# EAGLE board MegaFly_rev4 (EAGLE 6.1)
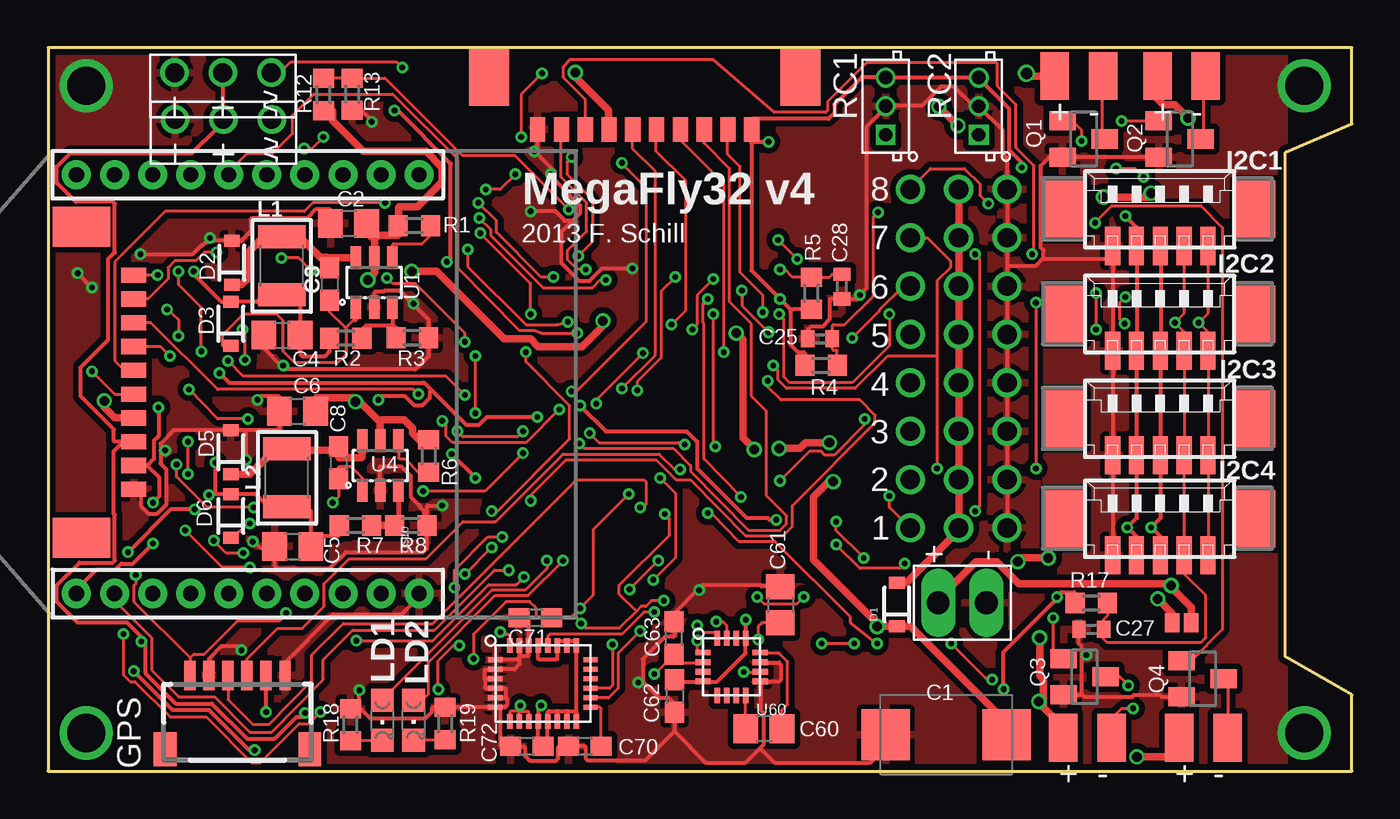
[diagram p2: board, top side]
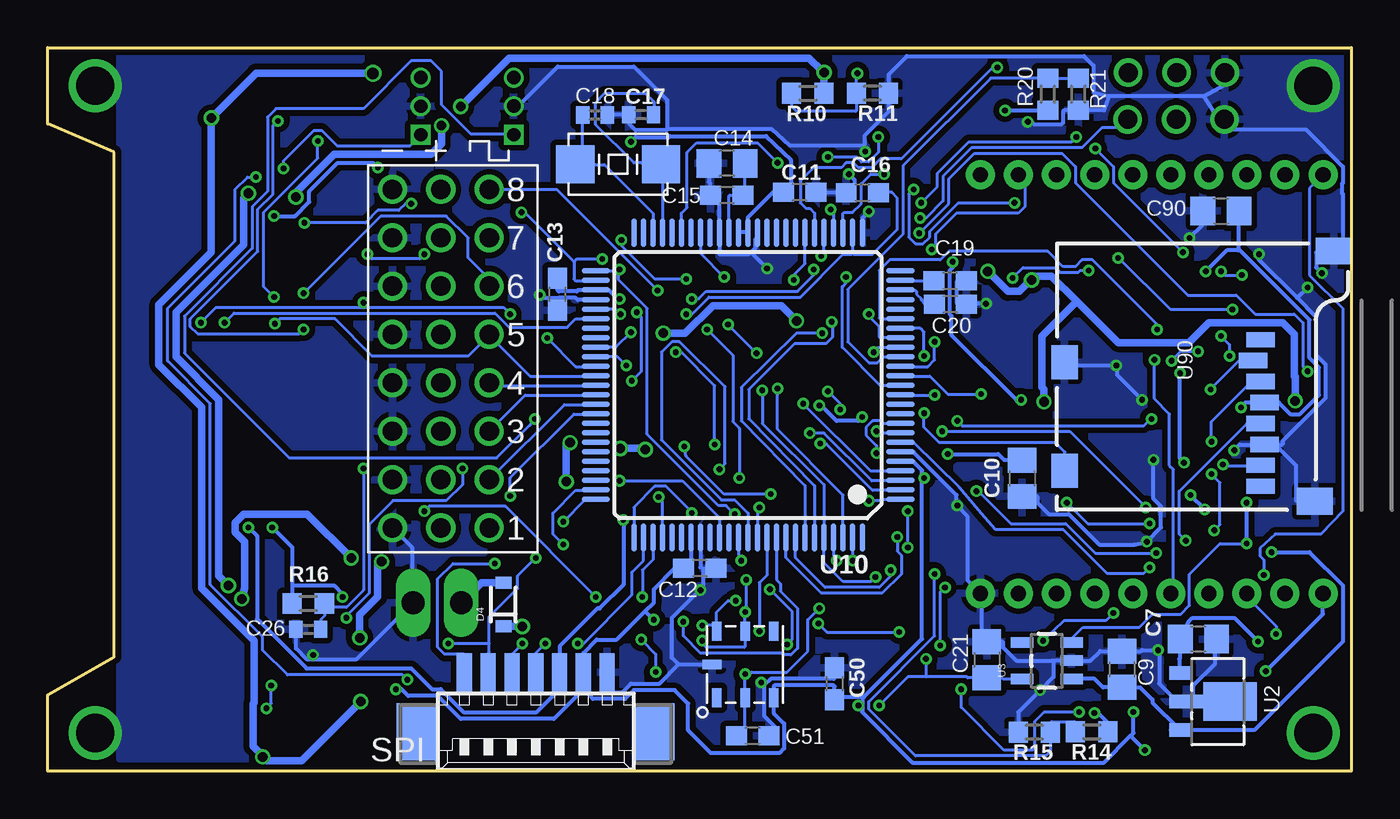
[diagram p3: board, bottom side, seen from below]

Size 68.5 x 38 mm. Coordinates in mm from the lower left corner, seen from the top.
Outline: 0,0 68.5,0 68.5,4 65,6 65,32.5 68.5,34 68.5,38 0,38 0,0
Copper layers (1*16): Top 0.035mm / dielectric 1mm / Bottom 0.035mm
Design rules: minimum track width 0.15mm, minimum drill 0.3mm, track to track 0.15mm, track to pad 0.15mm, pad to pad 0.15mm, via to via 0.15mm, smd to smd 0.15mm, copper to edge 10mil, drill to drill 8mil, minimum pad ring 6mil, minimum via ring 6mil, stop-mask expansion 4mil, vias tented up to drill 0.51mm, thermal gap 10mil
Net classes: 0 default: width 0.15 mm, drill 0.3 mm, clearance 0.15 mm; 1 power: width 0.2 mm, drill 0.3 mm, clearance 0.15 mm; 2 more_power: width 0.4 mm, drill 0.5 mm, clearance 0.15 mm

## Footprints (pad centres in the part's own frame; a part is rotated, then mirrored left to right if it is on the bottom)
MOLEX_CONNECTOR_10PINS = smd 0.8 x 1.3: P$1 -11.65,-0.65; P$2 -10.4,-0.65; P$3 -9.15,-0.65; P$4 -7.9,-0.65; P$5 -6.65,-0.65; P$6 -5.4,-0.65; P$7 -4.15,-0.65; P$8 -2.9,-0.65; P$9 -1.65,-0.65; P$10 -0.4,-0.65 | smd 2.1 x 3: P$11 -14.2,-3.4; P$12 2.15,-3.4
D/7343-31R = smd 2.55 x 2.7: + 3.175,0; - -3.175,0
C0805 = smd 1.3 x 1.5: 1 -0.95,0; 2 0.95,0
C0603 = smd 1.1 x 1: 1 -0.85,0; 2 0.85,0
C0402 = smd 0.7 x 0.9: 1 -0.65,0; 2 0.65,0
SOD-323 = smd 0.63 x 0.83: 1 -1.15,0; 2 1.15,0
CON-JST2_SM06B-SRSS-TB = smd 0.6 x 1.55: 1 -2.5,2.975; 2 -1.5,2.975; 3 -0.5,2.975; 4 0.5,2.975; 5 1.5,2.975; 6 2.5,2.975 | smd 1.2 x 1.8: FIT@1 -3.8,-0.9; FIT@2 3.8,-0.9
MOLEX_CONNECTOR_5_PINS_VERTICAL = smd 0.8 x 2: 1 2.48,-2.57; 2 1.23,-2.57; 3 -0.02,-2.57; 4 -1.27,-2.57; 5 -2.52,-2.57 | smd 2.1 x 3: S1 4.98,-0.645; S2B -5,-0.645
C1210 = smd 1.2 x 2.5: 1 -1.524,0; 2 1.524,0
CHIPLED_0805 = smd 1.2 x 1.2: A 0,-1.05; C 0,1.05
SOT23 = smd 1 x 1.4: 1 -0.95,-1.1; 2 0.95,-1.1; 3 0,1.1
R0603 = smd 1 x 1.1: 1 -0.85,0; 2 0.85,0
MOLEX_CONNECTOR_7PINS = smd 0.8 x 2: 1 3.75,-2.5; 2 2.5,-2.5; 3 1.25,-2.5; 4 0,-2.5; 5 -1.25,-2.5; 6 -2.5,-2.5; 7 -3.75,-2.5 | smd 2.1 x 3: S1 6.25,0.625; S2 -6.25,0.625
SOT23-6 = smd 0.55 x 1.2: 1 -0.95,-1.3; 2 0,-1.3; 3 0.95,-1.3; 4 0.95,1.3; 5 0.015,1.3; 6 -0.95,1.3
SOT89 = smd 0.7 x 1.1: 1 -1.5,-1.75; 3 1.5,-1.75 | smd 0.7 x 1.8: 2 0,-1.4 | smd 2 x 2.8: 4 0,0.9
SOT23-5 = smd 0.55 x 1.2: 1 -0.95,-1.3; 2 0,-1.3; 3 0.95,-1.3; 4 0.95,1.3; 5 -0.95,1.3
TQFP100 = smd 1.5 x 0.3: 1 -8,6; 2 -8,5.5; 3 -8,5; 4 -8,4.5; 5 -8,4; 6 -8,3.5; 7 -8,3; 8 -8,2.5; 9 -8,2; 10 -8,1.5; 11 -8,1; 12 -8,0.5; 13 -8,0; 14 -8,-0.5; 15 -8,-1; 16 -8,-1.5; 17 -8,-2; 18 -8,-2.5; 19 -8,-3; 20 -8,-3.5; 21 -8,-4; 22 -8,-4.5; 23 -8,-5; 24 -8,-5.5; 25 -8,-6; 51 8,-6; 52 8,-5.5; 53 8,-5; 54 8,-4.5; 55 8,-4; 56 8,-3.5; 57 8,-3; 58 8,-2.5; 59 8,-2; 60 8,-1.5; 61 8,-1; 62 8,-0.5; 63 8,0; 64 8,0.5; 65 8,1; 66 8,1.5; 67 8,2; 68 8,2.5; 69 8,3; 70 8,3.5; 71 8,4; 72 8,4.5; 73 8,5; 74 8,5.5; 75 8,6 | smd 0.3 x 1.5: 26 -6,-8; 27 -5.5,-8; 28 -5,-8; 29 -4.5,-8; 30 -4,-8; 31 -3.5,-8; 32 -3,-8; 33 -2.5,-8; 34 -2,-8; 35 -1.5,-8; 36 -1,-8; 37 -0.5,-8; 38 0,-8; 39 0.5,-8; 40 1,-8; 41 1.5,-8; 42 2,-8; 43 2.5,-8; 44 3,-8; 45 3.5,-8; 46 4,-8; 47 4.5,-8; 48 5,-8; 49 5.5,-8; 50 6,-8; 76 6,8; 77 5.5,8; 78 5,8; 79 4.5,8; 80 4,8; 81 3.5,8; 82 3,8; 83 2.5,8; 84 2,8; 85 1.5,8; 86 1,8; 87 0.5,8; 88 0,8; 89 -0.5,8; 90 -1,8; 91 -1.5,8; 92 -2,8; 93 -2.5,8; 94 -3,8; 95 -3.5,8; 96 -4,8; 97 -4.5,8; 98 -5,8; 99 -5.5,8; 100 -6,8
BMP180 = smd 0.5 x 1: 1 -1.5,-1.75; 2 0,-1.75; 3 1.5,-1.75; 4 1.5,1.75; 5 0,1.75; 6 -1.5,1.75 | smd 1 x 0.5: 7 -1.75,0
LPCC16_0.5MM = smd 0.8 x 0.3: P$1 -1.5,0.75; P$2 -1.5,0.25; P$3 -1.5,-0.25; P$4 -1.5,-0.75; P$9 1.5,-0.75; P$10 1.5,-0.25; P$11 1.5,0.25; P$12 1.5,0.75 | smd 0.3 x 0.8: P$5 -0.75,-1.5; P$6 -0.25,-1.5; P$7 0.25,-1.5; P$8 0.75,-1.5; P$13 0.75,1.5; P$14 0.25,1.5; P$15 -0.25,1.5; P$16 -0.75,1.5
LSM330DLC = smd 0.75 x 0.28: P$1 -2.5,1.25; P$2 -2.5,0.75; P$3 -2.5,0.25; P$4 -2.5,-0.25; P$5 -2.5,-0.75; P$6 -2.5,-1.25; P$15 2.5,-1.25; P$16 2.5,-0.75; P$17 2.5,-0.25; P$18 2.5,0.25; P$19 2.5,0.75; P$20 2.5,1.25 | smd 0.28 x 0.75: P$7 -1.75,-2; P$8 -1.25,-2; P$9 -0.75,-2; P$10 -0.25,-2; P$11 0.25,-2; P$12 0.75,-2; P$13 1.25,-2; P$14 1.75,-2; P$21 1.75,2; P$22 1.25,2; P$23 0.75,2; P$24 0.25,2; P$25 -0.25,2; P$26 -0.75,2; P$27 -1.25,2; P$28 -1.75,2
MICRO-SD-SOCKET-PP = smd 0.8 x 1.5: 1 -8.94,10.7; 2 -7.84,10.3; 3 -6.74,10.7; 4 -5.64,10.9; 5 -4.54,10.7; 6 -3.44,10.9; 7 -2.34,10.7; 8 -1.24,10.7 | smd 1.8 x 1.4: CD1 -2.05,0.4; CD2 -7.75,0.4 | smd 1.4 x 1.9: GND1 -13.6,14.55; GND3 -0.45,13.55
HEADER3X8 = drill 1.016: P$1 -2.54,10.16; P$2 0,10.16; P$3 2.54,10.16; P$4 -2.54,7.62; P$5 0,7.62; P$6 2.54,7.62; P$7 -2.54,5.08; P$8 0,5.08; P$9 2.54,5.08; P$10 -2.54,2.54; P$11 0,2.54; P$12 2.54,2.54; P$13 -2.54,0; P$14 0,0; P$15 2.54,0; P$16 -2.54,-2.54; P$17 0,-2.54; P$18 2.54,-2.54; P$19 -2.54,-5.08; P$20 0,-5.08; P$21 2.54,-5.08; P$22 -2.54,-7.62; P$23 0,-7.62; P$24 2.54,-7.62
SOLDER_JUMPER_2WAY = smd 0.75 x 1: P$1 -0.5,0; P$2 0.5,0
SMD_CRYSTAL_ABM = smd 2 x 2: P$1 -2.25,0; P$2 2.25,0
POWER = drill 1.2 long: P$1 0,2.54; P$2 0,0
XBEE-1 = drill 0.8 pad 1.524: 1 -11,20; 2 -11,18; 3 -11,16; 4 -11,14; 5 -11,12; 6 -11,10; 7 -11,8; 8 -11,6; 9 -11,4; 10 -11,2; 11 11,2; 12 11,4; 13 11,6; 14 11,8; 15 11,10; 16 11,12; 17 11,14; 18 11,16; 19 11,18; 20 11,20
JST_1.5MM_3WAY = drill 0.7 square: P$1 0,1.5 | drill 0.7: P$2 0,0; P$3 0,-1.5
POWER_SMALL_SMD = smd 1.5 x 2.5: + -1.27,0; - 1.27,0
SERVO_COMPACT = drill 1: P$1 0,2.54; P$2 0,0; P$3 0,-2.54

## Placement (x,y rotation side)
ANA  MOLEX_CONNECTOR_10PINS  [MOLEX_CONNECTOR_10PINS]  5.15,14.4 270 top
C1  100uF  [D/7343-31R]  47.18,1.91 0 top
C2  10uF  [C0805]  15.78,28.77 0 top
C3  100nF  [C0603]  14.79,25.58 270 top
C4  10uF  [C0805]  12.29,22.9 0 top
C5  10uF  [C0805]  12.85,11.8 0 top
C6  10uF  [C0805]  13.1,18.9 0 top
C7  10uF  [C0805]  8.03,6.93 180 bottom
C8  100nF  [C0603]  15.25,16.2 270 top
C9  10uF  [C0805]  12.05,5.35 270 bottom
C10  10uF  [C0805]  17.3,15.38 270 bottom
C11  100nF  [C0603]  28.99,30.41 180 bottom
C12  100nF  [C0603]  34.23,10.67 180 bottom
C13  100nF  [C0603]  41.7,25.05 90 bottom
C14  10uF  [C0805]  32.8,31.92 180 bottom
C15  100nF  [C0603]  32.81,30.26 180 bottom
C16  100nF  [C0603]  25.69,30.38 0 bottom
C17  22pF  [C0402]  37.31,34.48 180 bottom
C18  22pF  [C0402]  39.74,34.46 0 bottom
C19  100nF  [C0603]  21.08,25.75 180 bottom
C20  100nF  [C0603]  21.07,24.53 180 bottom
C21  10uF  [C0805]  19.15,5.85 270 bottom
C25  22pF  [C0402]  40.55,22.7 0 top
C26  22pF  [C0402]  54.8,7.45 0 bottom
C27  22pF  [C0402]  54.8,7.45 0 top
C28  22pF  [C0402]  41.7,25.45 90 top
C50  100nF  [C0603]  27.16,4.59 270 bottom
C51  100nF  [C0603]  31.45,1.85 180 bottom
C60  220nF  [C0805]  37.6,2.22 180 top
C61  4.7uF  [C0805]  38.47,8.74 270 top
C62  100nF  [C0603]  32.92,3.94 270 top
C63  100nF  [C0603]  32.89,6.99 90 top
C70  100nF  [C0603]  28.2,1.3 180 top
C71  100nF  [C0603]  25.6,8.05 180 top
C72  100nF  [C0603]  25.15,1.3 180 top
C90  10uF  [C0805]  6.85,29.42 0 bottom
D1  [SOD-323]  44.6,8.75 90 top
D2  [SOD-323]  9.65,26.7 90 top
D3  [SOD-323]  9.6,23.5 90 top
D4  [SOD-323]  44.55,8.75 90 bottom
D5  [SOD-323]  9.6,16.75 90 top
D6  [SOD-323]  9.6,13.4 90 top
GPS  ADRUPILOT_GPS_HEADERSIDE  [CON-JST2_SM06B-SRSS-TB]  9.95,2.05 0 top
I2C1  I2C_BUS_PICOVERTICAL  [MOLEX_CONNECTOR_5_PINS_VERTICAL]  58.45,30.15 0 top
I2C2  I2C_BUS_PICOVERTICAL  [MOLEX_CONNECTOR_5_PINS_VERTICAL]  58.45,24.65 0 top
I2C3  I2C_BUS_PICOVERTICAL  [MOLEX_CONNECTOR_5_PINS_VERTICAL]  58.45,19.15 0 top
I2C4  I2C_BUS_PICOVERTICAL  [MOLEX_CONNECTOR_5_PINS_VERTICAL]  58.45,13.9 0 top
L1  10uH  [C1210]  12.27,26.54 270 top
L2  10uH  [C1210]  12.55,15.4 270 top
LD1  green  [CHIPLED_0805]  17.56,2.67 180 top
LD2  red  [CHIPLED_0805]  19.2,2.68 180 top
Q1  N-CHANNEL_SOT23  [SOT23]  54.4,33.2 270 top
Q2  N-CHANNEL_SOT23  [SOT23]  59.45,33.2 270 top
Q3  N-CHANNEL_SOT23  [SOT23]  54.45,4.95 270 top
Q4  N-CHANNEL_SOT23  [SOT23]  60.65,4.85 270 top
R1  100k  [R0603]  19.24,28.65 180 top
R2  31.6k  [R0603]  15.63,22.74 0 top
R3  10k  [R0603]  19.13,22.76 0 top
R4  6k8  [R0603]  40.61,21.31 0 top
R5  6k8  [R0603]  40.1,25.1 90 top
R6  100k  [R0603]  20,16.55 90 top
R7  62k  [R0603]  16.15,12.9 0 top
R8  10k  [R0603]  19.05,12.9 0 top
R10  10k  [R0603]  28.56,35.59 0 bottom
R11  1k  [R0603]  25.16,35.6 180 bottom
R12  10k  [R0603]  14.46,35.53 270 top
R13  1k  [R0603]  15.98,35.55 90 top
R14  5.6k  [R0603]  13.64,2.07 0 bottom
R15  1k  [R0603]  16.65,2.05 0 bottom
R16  6k8  [R0603]  54.81,8.8 0 bottom
R17  6k8  [R0603]  54.81,8.83 0 top
R18  1k  [R0603]  15.88,2.44 270 top
R19  1k  [R0603]  20.86,2.5 270 top
R20  5.6k  [R0603]  15.95,35.55 270 bottom
R21  1k  [R0603]  14.35,35.55 90 bottom
SPI  MOLEX_CONNECTOR_7PINS  [MOLEX_CONNECTOR_7PINS]  42.85,2.7 180 bottom
U1  LM2734  [SOT23-6]  17.13,25.66 0 top
U2  LDO_3PINSOT89_MC78LXX  [SOT89]  7.27,3.66 270 bottom
U3  V_REG_MIC5235-3.3  [SOT23-5]  16,5.8 90 bottom
U4  LM2734  [SOT23-6]  17.45,16.05 0 top
U10  AT32UC3C1512/1256/1128  [TQFP100]  31.7,20.27 180 bottom
U50  BMP180  [BMP180]  31.85,5.6 0 bottom
U60  HMC5883L  [LPCC16_0.5MM]  35.91,5.47 0 top
U70  LSM330DLC  [LSM330DLC]  26,4.6 0 top
U90  USD-SOCKETNEW  [MICRO-SD-SOCKET-PP]  15.47,13.72 270 bottom
U$1  AVR32_JTAG+SERIAL  [MOLEX_CONNECTOR_10PINS]  25.32,33.05 180 top
U$3  SERVOCONNECTOR_X8STANDARD  [HEADER3X8]  47.84,22.93 180 bottom
U$4  SOLDER_JUMPER_2WAY  [SOLDER_JUMPER_2WAY]  59.55,7.8 0 top
U$8  CRYSTAL  [SMD_CRYSTAL_ABM]  38.52,31.88 0 bottom
U$9  POWER  [POWER]  49.3,8.84 90 top
U$10  XBEE-1B1  [XBEE-1]  21.49,20.33 90 top
U$11  SPEKTRUM_RECEIVER  [JST_1.5MM_3WAY]  44,34.93 180 top
U$12  SPEKTRUM_RECEIVER  [JST_1.5MM_3WAY]  48.89,34.92 180 top
U$13  POWERSMALL_SMD  [POWER_SMALL_SMD]  54.15,36.5 0 top
U$15  POWERSMALL_SMD  [POWER_SMALL_SMD]  59.55,36.5 0 top
U$16  SENSOR  [SERVO_COMPACT]  9.21,34.23 270 top
U$17  SENSOR  [SERVO_COMPACT]  9.18,36.68 270 top
U$19  POWERSMALL_SMD  [POWER_SMALL_SMD]  54.6,1.75 0 top
U$20  POWERSMALL_SMD  [POWER_SMALL_SMD]  60.7,1.75 0 top

## Tracks (layer width: path | path; a pad name or v marks a point on that pad's centre or on a via)
3V3_ANA  (via drill 0.3)
  Top 0.15: U70.P$7 24.25,3.1 24.3,3.15 24.7,3.15 | 24.75,3.1 24.7,3.15 | U70.P$8 24.75,3.1 | U70.P$9 25.25,3.1 25.2,3.15 24.8,3.15 24.75,3.1 | v24.8,3.45 24.75,3.4 24.75,3.2 24.7,3.15 | U60.P$2 34.4,5.7 32.95,5.7 32.9,5.75 32.9,6.1 C63.1 32.85,5.7 32.45,5.7 v31.85,5.1 | v35.05,17.05 34.95,17.15 v34.95,24 | v30.5,14.55 28.65,12.7 28.65,9.25 v27.95,8.55 27.45,8.05 C71.1 25.7,8.05 25.65,8.1 25.65,8.55 25.3,8.9 24.05,8.9 22.35,7.2 v22.35,5.9
  Bottom 0.15: v24.8,3.45 23.3,4.95 22.35,4.95 | 22.35,4.95 20.2,4.95 20.15,4.9 C21.2 18.35,4.9 18.3,4.85 U3.5 | 26.2,27.2 26.15,27.15 25.15,27.15 23.85,28.45 23.85,30.1 24.15,30.4 24.8,30.4 C16.2 | U10.27 26.2,27.2 | C51.2 31.9,1.85 31.85,1.9 U50.2 31.85,4.85 31.73,4.97 | v27.95,8.55 28.55,7.95 28.55,6.3 29.65,5.2 31.5,5.2 31.73,4.97 | 31.73,4.97 v31.85,5.1 | v34.95,24 34.65,24 33.75,24.9 28.95,24.9 26.7,27.15 26.25,27.15 26.2,27.2 | v35.05,17.05 34.95,16.55 32.95,14.55 v30.5,14.55 | v22.35,5.9 22.35,4.95
5V_ANA  (via drill 0.3)
  Top 0.2: U$17.P$2 9.2,36.2 9.2,33.8 U$16.P$2 9.1,33.8 8.9,33.8 7.55,32.45 1.15,32.45 0.45,31.75 0.45,30.9 1.45,29.9 3.4,29.9 3.5,29.8 3.5,27.25 3.15,26.9 3.15,22.65 1.7,21.2 1.7,19.7 3.45,17.95 3.45,17.35 3.5,17.3 3.85,17.3 3.9,17.25 | v13.5,3.05 13.3,2.85 13.05,2.85 11.9,1.7 10.45,1.7 8.6,3.55 6.7,3.55 5.1,5.15 5.1,6.6 v4.9,6.8 4.95,6.85 4.95,7 4.15,7.8 1.55,7.8 0.45,8.9 0.45,9.75 1.65,10.95 3.4,10.95 3.5,11.05 3.5,13.45 3.45,13.5 3.45,16.8 3.9,17.25 | ANA.P$8 3.95,17.3 3.9,17.25
  Bottom 0.2: v13.5,3.05 13.3,3.05 12.8,2.55 12.8,2.1 R14.2 | v4.9,6.8 6.15,8.05 8.35,8.05 8.5,7.9 9,6.95 C7.2 9,6.85 9,5.95 9.05,5.9 9.05,5.2 U2.1
+3V3  (via drill 0.3)
  Top 0.2: R2.1 14.8,22.7 14.8,22.05 14.55,21.8 13.35,21.8 13.25,21.9 13.25,22.85 C4.2 13.25,23 13.25,24.95 13.2,25 12.35,25 L1.2 12.25,25 11.3,25 10.95,24.65 D3.2 9.1,24.65 7.65,26.1 v7.65,26.25 | 39.05,24.2 39.1,24.25 R5.1 | 39.05,24.2 39,24.15 39,22.4 39.4,22 39.7,22 39.75,21.95 39.75,21.35 R4.1 | 39.05,24.2 v38.45,24.8 36.95,26.3 36.95,33 37,33.05 | 37,33.05 v37.85,33.05 | 37,33.05 36.95,33.1 36.95,33.65 U$1.P$1 36.95,33.7 36.95,34.2 37,34.25 41,34.25 41.3,34.55 41.3,35 42.75,36.45 44,36.45 U$11.P$3 44.1,36.45 48.85,36.45 U$12.P$3 48.95,36.35 50.5,34.8 50.5,32.6 51.15,31.95 v51.15,31.7 | I2C4.4 57.2,11.35 57.2,12.3 v56.7,12.8 57.2,13.3 57.2,16.55 I2C3.4 57.2,16.65 57.2,22 I2C2.4 57.2,22.1 57.2,27.55 I2C1.4 57.2,27.65 57.2,28.55 v56.6,29.15 | R17.1 53.95,8.85 53.95,9.35 53.9,9.4 53.25,9.4 v53,9.15 52.95,9.1 52.95,9 50.2,6.25 v50.2,4.3 | C62.1 32.9,4.75 32.9,4.7 34.4,4.7 U60.P$4 34.5,4.7 35.15,4.7 36.65,6.2 36.65,6.95 U60.P$13 36.65,7.05 v36.65,7.95 | U70.P$25 25.75,5.9 25.8,5.85 26.7,5.85 26.75,5.9 U70.P$23 26.75,6.85 27.25,6.85 U70.P$22 27.3,6.85 27.75,6.85 U70.P$21 27.75,3.2 27.7,3.15 | 26.75,3.1 U70.P$12 | 26.75,3.1 26.7,3.15 26.3,3.15 26.25,3.1 U70.P$11 26.25,1.3 C72.1 25.75,1.3 U70.P$10 25.75,3.3 v25.9,3.45 | 27.25,3.1 U70.P$13 | 27.25,3.1 27.2,3.15 26.8,3.15 26.75,3.1 | U70.P$14 27.75,3.1 27.7,3.15 | 27.7,3.15 27.3,3.15 27.25,3.1 | 5.2,16.05 ANA.P$9 | 5.2,16.05 5.55,16.4 5.55,17.35 5.8,17.6 v5.8,19.1 | 5.2,16.05 5.85,15.4 5.85,14.45 v5.5,14.1 | v5.5,11.95 4.45,10.9 3.85,10.9 3.55,10.6 2.55,10.6 1.5,9.55 1.5,9.35 U$10.1 | v11.45,3.1 GPS.5
  Top 0.2: v4.5,5.25 6.55,3.2 8.45,3.2 10.55,1.1 v10.85,1.1 | v22.45,15.4 v21.2,16.65
  Bottom 0.15: U3.3 14.7,6.95 14.1,7.55 11.15,7.55 10.45,8.25 8.95,8.25 8.5,8.7 8.5,10.35 6.9,11.95 v5.5,11.95
  Bottom 0.2: 5.9,27.4 C90.2 | 5.9,27.4 2.2,23.7 2.2,21.7 1.7,21.2 1.7,19.75 2.7,18.75 3.2,18.75 3.8,19.35 4.5,19.35 U90.4 4.65,19.35 5.55,19.35 v5.8,19.1 | v7.65,26.25 6.55,27.35 5.95,27.35 5.9,27.4 | C13.2 41.7,25.85 41.7,25.25 41.65,25.2 40.7,25.2 40.65,25.25 39.7,25.25 U10.53 39.65,25.25 39,25.25 38.55,24.8 v38.45,24.8 | U10.39 32.2,28.3 31.75,28.3 U10.38 31.7,29.1 30.4,30.4 C11.2 29.75,30.4 29.45,30.4 29.45,32.1 30.75,33.35 35.8,33.35 35.85,33.3 37.6,33.3 v37.85,33.05 | 55.65,9.75 55.65,11.75 v56.7,12.8 | 55.65,9.75 55.65,8.85 R16.1 | v53,9.15 53,9.3 53.45,9.75 55.65,9.75 | U10.82 34.7,10.8 34.65,10.7 35.05,10.65 C12.2 35.15,10.65 35.55,10.65 36.65,9.55 36.65,8.85 37.1,8.4 | 37.1,8.4 38.6,6.9 39.65,6.9 40.35,6.2 SPI.6 | 37.1,8.4 v36.65,7.95 | SPI.6 40.35,4.3 39.85,3.8 38.15,3.8 37.7,4.25 35.55,4.25 34.85,3.55 34.85,2.15 33.65,0.95 30.05,0.95 29.8,1.2 29.8,2.5 30.35,3.05 U50.3 30.35,4.45 30.3,4.5 27.2,4.5 27.15,4.45 C50.2 27.1,3.9 25.7,3.9 | v50.2,4.3 49.9,4.3 49.55,3.95 48,3.95 46.8,2.75 41.9,2.75 40.4,4.25 SPI.6 | v51.15,31.7 51.4,31.95 53.25,31.95 54.75,30.45 54.75,29.9 55.5,29.15 v56.6,29.15 | v5.5,11.95 v5.5,14.1 | 22.55,15.4 22.55,6.95 25.6,3.9 25.7,3.9 | 22.55,15.4 22.55,15.8 23,16.25 23.7,16.25 U10.5 | v11.45,3.1 11.45,2 11.6,1.85 | 11.6,1.85 13,0.45 23.05,0.45 25.7,3.1 25.7,3.45 | 25.7,3.9 25.7,3.45 | 25.7,3.45 v25.9,3.45 | v4.5,5.25 1.5,8.25 1.5,9.3 U$10.1 | 11.6,1.85 v10.85,1.1 | v21.2,16.65 18.55,16.65 18.25,16.35 17.3,16.35 C10.1 | v22.45,15.4 22.55,15.4
+6V  (via drill 0.3)
  Top 0.2: I2C1.3 58.45,27.55 58.45,22.1 I2C2.3 58.45,22 58.45,16.65 I2C3.3 58.45,16.55 58.45,13.3 v57.95,12.8 58.45,12.3 58.45,11.35 I2C4.3 | R7.1 15.3,12.4 15.25,12.35 13.85,12.35 13.8,12.3 C5.2 13.8,13.65 13.55,13.9 12.6,13.9 L2.2 12.55,13.9 11.55,13.9 10.9,14.55 D6.2 8.85,14.55 8.8,14.6 | v18.2,34.7 18.25,34.65 18.4,34.65 21.15,31.9 21.15,26.95 v20.95,26.75 | v17.35,19.5 17.55,19.7 18.75,19.7 19.25,19.2 19.65,19.2 20.05,19.6 20.05,19.95 | 20.05,19.95 20.15,20 19.75,20.4 9.5,20.4 v9,20.9 | 8.8,14.6 v8.8,16.2 | v4.2,11.5 6.45,13.75 v7.7,13.75 | v8.45,14.5 8.55,14.5 8.6,14.55 8.75,14.55 8.8,14.6 | v38.25,13.2 37.9,13.2 37.8,13.3 36.7,13.3 34.1,15.9 34.1,17.3 33.55,17.85 29.3,17.85 v27.95,19.2 | v25.7,18.6 23.05,18.6 22.65,18.2 21.95,18.2 20.2,19.95 20.05,19.95
  Bottom 0.2: v57.95,12.8 57.5,12.35 57.5,8 54.9,5.4 49.4,5.4 48.3,4.3 47.85,4.3 46.65,3.1 42.8,3.1 41.6,4.3 SPI.5 41.6,6.55 39.6,8.55 39.5,8.55 38.25,9.8 v38.25,13.2 | U3.1 13.5,4.85 13.05,4.4 C9.2 11.1,4.4 10.45,3.75 10.45,3.6 9.1,2.25 9.5,2.15 9.05,2.15 U2.3 8.95,2.15 5.1,2.15 0.45,6.8 0.45,9.75 2.2,11.5 v4.2,11.5 | v18.2,34.7 R20.2 | v20.95,26.75 20.95,26.45 21.1,26.3 21.1,24 21,23.9 21,22.9 17.6,19.5 v17.35,19.5 | v9,20.9 9,16.4 v8.8,16.2 | v8.45,14.5 v7.7,13.75 | v27.95,19.2 27.85,19.2 27.05,18.4 25.9,18.4 v25.7,18.6
+12V  (via drill 0.5)
  Top 0.4: v27.7,36.7 27.7,36.45 29.45,34.7 29.45,33.7 U$1.P$7 | U$4.P$2 60.05,8.6 58.95,9.7 | 58.95,9.7 58.8,9.85 51,9.85 49.85,11 48.75,11 46.8,9.05 46.8,8.85 U$9.P$1 | v47.8,33.9 v46.8,34.9 | v55.45,30.15 57.75,30.15 v57.95,30.35 | v59,9.75 58.95,9.7
  Bottom 0.4: R10.2 v27.7,36.7 27.85,36.8 28.5,37.45 44.25,37.45 v46.8,34.9 | D4.2 45.7,9.9 U$9.P$1 | v47.8,33.9 47.8,32.95 48.35,32.4 53.45,32.4 55.45,30.4 v55.45,30.15 | v57.95,30.35 58.2,30.1 58.2,27.65 61.75,24.1 61.75,21.75 59.5,19.5 59.5,10.25 v59,9.75
ADC2  (via drill 0.3)
  Top 0.15: v5.75,26.05 ANA.P$1 | v6.85,26.25 6.85,25.55 8.05,24.35 v8.05,22.05 | v9.45,21.55 10.25,20.75 20.9,20.75 v21.9,19.75
  Bottom 0.15: v5.75,26.05 6.65,26.05 v6.85,26.25 | v8.05,22.05 8.95,22.05 v9.45,21.55 | v21.9,19.75 23.7,19.75 U10.12
ADC3  (via drill 0.3)
  Top 0.15: ANA.P$2 5.25,24.8 6.3,25.85 6.3,26.45 6.65,26.8 7.75,26.8 8.2,27.25 v8.85,27.25 | v13.45,32.7 13.85,32.7 v14.45,33.3 | v22.6,29.85 23.55,28.9 23.55,28.3 25.9,25.95 v26.55,25.95
  Bottom 0.15: v8.85,27.25 12.5,30.9 12.5,31.75 v13.45,32.7 | v14.45,33.3 14.7,33.05 20.1,33.05 21.75,31.4 21.75,30.7 v22.6,29.85 | v26.55,25.95 26.55,25.65 26.75,25.45 26.75,22.25 24.75,20.25 23.7,20.25 U10.13
ADC4  (via drill 0.3)
  Top 0.15: ANA.P$3 5.4,23.55 8.9,20.05 19.2,20.05 v19.45,19.8
  Bottom 0.15: v19.45,19.8 21.2,19.8 22.15,20.75 23.7,20.75 U10.14
ADC5  (via drill 0.3)
  Top 0.15: ANA.P$4 5.9,22.3 v6.4,21.8 | v6.85,22.85 6.85,23.7 v6.25,24.25 | v12.25,26.95 13.15,26.95 v13.8,26.3 | v17.8,25.9 18.1,25.6 19.3,25.6 21.9,23 v21.9,22.55
  Bottom 0.15: v6.4,21.8 6.4,22.4 v6.85,22.85 | v6.25,24.25 9.5,24.25 v12.25,26.95 | v13.8,26.3 14.25,26.3 14.35,26.2 15.3,26.2 15.55,26.45 17.25,26.45 v17.8,25.9 | v21.9,22.55 21.9,21.6 22.25,21.25 23.7,21.25 U10.15
ADC6
  Bottom 0.15: R21.2 R20.1 18.95,36.4 23.55,31.8 23.55,28.2 26.45,25.3 26.45,22.55 25.35,21.45 24.9,21.45 24.6,21.75 23.7,21.75 U10.16
ADC7  (via drill 0.3)
  Top 0.15: v25.1,22 25.1,21.5 27.4,19.2 27.4,17.45 23.6,13.65 v23.3,13.65 | v21.9,10.35 v23.3,11.75
  Bottom 0.15: R14.1 14.5,2.1 14.5,2.55 14.55,2.6 15.75,2.6 15.8,2.55 R15.2 15.8,2 15.8,1.05 16.05,0.8 22.9,0.8 25.35,3.25 25.35,3.65 21.9,7.1 v21.9,10.35 | v25.1,22 24.85,22.25 23.7,22.25 U10.17 | v23.3,11.75 v23.3,13.65
ADC10  (via drill 0.3)
  Top 0.15: R12.1 14.5,36.4 15.95,36.4 R13.2 16.05,36.4 17.7,36.4 21.75,32.35 24.5,32.35 v27.35,29.5
  Bottom 0.15: U10.29 27.2,29.35 v27.35,29.5
ADC11  (via drill 0.3)
  Top 0.15: v27.85,27.05 28.6,27.8 28.6,30 27.25,31.35 27.25,32 v27.5,32.25 | v24.85,33.3 24.85,35.55 v25.95,36.65
  Bottom 0.15: R10.1 29.4,35.55 29.4,34.9 29.15,34.65 26.05,34.65 26,34.7 R11.2 26,35.65 26,36.6 v25.95,36.65 | U10.30 27.7,27.2 v27.85,27.05 | v27.5,32.25 26,32.25 25.75,32 25.35,32 24.85,32.5 v24.85,33.3
ADC12  (via drill 0.3)
  Top 0.15: v18.6,36.95 18.3,37.25 12.75,37.25 11.75,36.25 U$17.P$1
  Bottom 0.15: U10.31 28.2,29.3 28.45,29.55 28.65,29.55 28.95,29.85 28.95,31 28.25,31.7 26.8,31.7 26.55,31.95 26.15,31.95 25.9,31.7 25.2,31.7 24.75,32.15 23.65,32.15 18.95,36.85 18.7,36.8 v18.6,36.95
ADC13  (via drill 0.3)
  Top 0.15: v29.3,25.8 29,25.8 28.6,25.4 26,25.4 23.25,28.15 23.25,28.45 v22.65,29.05
  Bottom 0.15: U10.32 28.7,26.65 29.3,26.05 v29.3,25.8 | v22.65,29.05 22.35,29.05 21.45,29.95 21.45,31.25 19.95,32.75 14.15,32.75 13.1,33.8 11.75,33.8 U$16.P$1
BAT_FILTERED  (via drill 0.5)
  Top 0.4: C1.+ 50.35,1.95 50.35,2.85 50.3,2.9 50,2.9 45.3,7.6 D1.1 v43.55,7.6 43.4,7.7 43.4,7.9 40.2,11.1 40.2,14.4 41,15.2 v41.25,15.2 | R6.2 19.5,17.4 19.15,17.75 19.15,18 18.7,18.45 17.55,18.45 17.45,18.35 | 17.45,18.35 17.45,17.4 U4.5 | C6.2 14.05,19.55 14.1,19.6 16.15,19.6 16.25,19.5 | 16.25,19.5 17.3,18.45 17.45,18.35 | 17.15,27.95 17.35,28.15 18.35,28.15 18.4,28.2 18.4,28.6 R1.2 18.4,28.85 18.4,29.6 18.45,29.65 19.4,29.65 20.7,30.95 20.7,31.7 19.85,32.55 16.55,32.55 14.95,34.15 14.95,34.65 14.9,34.7 14.5,34.7 R12.2 | 17.15,27.95 17.15,27 U1.5 17.15,26.8 17.15,26.2 17.1,26.15 17.1,26.1 v16.8,25.8 | ANA.P$7 3.5,18.55 2.95,19.1 v2.95,19.45 | C2.2 16.75,28.75 16.75,28.3 17,28.05 17.15,27.95 | v16.15,19.4 16.25,19.5 | v41.05,17.25 39.8,17.25 39.5,16.95 v38.4,16.95 | v37.1,16.9 36.5,17.5 36.5,22.65 v36.15,23 | v29.15,23.65 29.15,23.4 28.05,22.3 25.75,22.3 25.35,22.7 23.95,22.7 20.4,26.25 v19.1,26.25
  Bottom 0.4: v43.55,7.6 D4.1 | v2.95,19.45 2.95,20.7 3,20.75 3,22.95 3.6,23.55 7.5,23.55 8.55,22.5 12.25,22.5 14.43,24.68 | 14.43,24.68 15.75,26 16.6,26 v16.8,25.8 16.95,25.7 17.45,25.2 18.05,25.2 v19.1,26.25 | v16.15,19.4 16.15,20.05 16.25,20.15 16.25,22.85 14.43,24.68 | v41.25,15.2 41.25,17.05 v41.05,17.25 | v38.4,16.95 37.15,16.95 v37.1,16.9 | v36.15,23 35,23 33.55,24.45 29.95,24.45 v29.15,23.65
COMPASS_DRDY  (via drill 0.3)
  Top 0.15: v35.1,7.85 35.45,7.85 35.65,7.65 35.65,7 U60.P$15
  Bottom 0.15: v35.1,7.85 35.1,7.1 34.2,6.2 29.95,6.2 29.85,6.1 29.45,6.1 29.1,6.45 29.1,8.55 30,9.45 30,9.85 30.2,10.05 U10.91
D_RXD  (via drill 0.3)
  Top 0.15: v28.25,26.35 27.8,26.35 27.3,26.85 27.3,27.35 28.3,28.35 28.3,29.85 26.95,31.2 26.95,33.7 U$1.P$9 | 34.4,24.55 v34.65,24.8 | 34.4,24.55 34.4,23.55 34.45,23.5 34.45,16.4 v36.4,14.4 | 34.45,24.5 34.4,24.55
  Bottom 0.15: v28.25,26.35 28.25,26.05 29.1,25.2 33.9,25.2 34.3,24.8 v34.65,24.8 | v36.4,14.4 36.4,14.35 36.2,14.15 U10.79
D_TXD  (via drill 0.3)
  Top 0.15: v51.7,27.15 51.8,27.25 51.8,31.8 50.85,32.75 50.85,35 49.85,36 49.85,37.2 43,37.2 40.95,35.15 40.95,34.7 40.85,34.6 38.15,34.6 34.95,37.35 27.4,37.35 27.05,36.95 27.05,36.45 28.2,35.3 28.2,33.7 U$1.P$8 | v48.7,27.15 48.95,26.9 48.95,13.9 v48.7,13.65 | v39.7,9.15 39.35,8.8 37.6,8.8 v37.25,9.15
  Bottom 0.15: v51.7,27.15 51.45,26.9 48.95,26.9 v48.7,27.15 | v48.7,13.65 48.45,13.9 44.45,13.9 v39.7,9.15 | v37.25,9.15 37.25,10.55 36.7,11.1 U10.78
DAC0  (via drill 0.3)
  Top 0.15: ANA.P$5 4,21.05 3.5,21.55 3.5,26.75 6.15,29.4 13.45,29.4 13.9,29.85 v17.7,29.85 | v23,30.55 23.75,30.55 v24.55,31.35
  Bottom 0.15: v17.7,29.85 20.65,29.85 22.15,28.35 22.15,28.05 22.5,27.7 22.9,27.7 23.25,28.05 23.25,30.3 v23,30.55 | v24.55,31.35 25.25,31.35 25.75,30.85 25.75,29.8 26.2,29.35 26.65,29.35 26.7,29.3 U10.28
DAC1  (via drill 0.3)
  Top 0.15: ANA.P$6 3.5,19.8 v2.3,21 | v22.7,28.25 25.35,25.6 v25.35,24
  Bottom 0.15: v2.3,21 2.55,21.25 2.55,23.55 3,24 5.05,24 6.05,25 8.6,25 14.5,30.9 14.5,31.75 15.2,32.45 19.8,32.45 21.15,31.1 21.15,29.8 v22.7,28.25 | v25.35,24 25.35,23.9 24.8,23.35 24.8,22.8 24.75,22.75 23.7,22.75 U10.18
GND  (via drill 0.3, 2)
  Top 0.2: 19.18,24.52 18.45,25.25 17.7,25.25 17.65,25.2 17.2,25.2 17.15,25.15 17.15,24.4 U1.2 | 19.18,24.52 20,23.7 20,22.8 R3.2 20,22.7 20,21.8 19.3,21.1 12.45,21.1 12.3,21.25 | 12.3,21.25 11.35,22.2 11.35,22.85 C4.1 | v19.2,24.55 19.18,24.52 | v12.35,21.3 12.3,21.25 | C2.1 14.85,28.8 14.85,29.45 14.8,29.5 14.05,29.5 13.6,29.05 10.7,29.05 10.65,29 10.65,28.35 10.15,27.85 D2.2 8.65,27.85 v8.5,28 8.1,27.6 8.05,27.6 7.6,27.15 v4.85,27.15 | 10.4,17.9 12.1,17.9 12.15,17.95 C6.1 12.15,19.65 12.1,19.7 11.2,19.7 v11,19.5 | 10.4,17.9 D5.2 6.6,17.9 5.9,17.2 5.9,16.85 | ANA.P$10 4.85,14.8 4.9,14.75 4.9,13.9 5.3,13.5 5.7,13.5 6.2,14 6.2,15.85 5.9,16.15 5.9,16.85 | 5.9,16.85 v6.15,16.85 | GPS.2 8.45,5.9 9.1,6.55 9.95,6.55 v10.15,6.35 | 19.75,13.55 19.85,13.45 | 19.85,13.45 19.9,13.4 R8.2 19.9,11.7 19.7,11.5 15.65,11.5 14.8,10.65 12.05,10.65 11.9,10.8 C5.1 11.9,11.3 11.85,11.25 v10.75,12.05 | v20.7,13.95 19.95,13.95 19.9,13.9 19.9,13.5 | 19.9,13.5 19.85,13.45 | GPS.6 12.45,5.7 14.95,8.2 18.55,8.2 19.45,9.1 19.45,9.3 U$10.10 19.5,9.35 | C71.2 25.2,8.05 25.25,8 U70.P$26 25.25,6.1 25.2,6.05 24.75,6.05 | U70.P$27 24.75,6.05 | 24.75,6.05 24.75,5.85 | 24.75,5.85 24.75,5.6 24.5,5.35 U70.P$2 23,5.35 22.95,5.3 22.95,4.9 23,4.85 | 24.75,5.85 U70.P$1 | 23,4.85 22.95,4.8 22.95,4.4 23,4.35 U70.P$4 24,4.35 24.05,4.3 24.05,3.85 | U70.P$3 23,4.85 | U70.P$6 24,3.35 24.1,3.45 24.1,3.8 24.05,3.85 | U70.P$5 24.05,3.85 | U70.P$6 23.75,3.3 23.75,1.35 23.8,1.3 C72.2 25,1.3 25.05,1.25 25.05,0.8 25.3,0.55 26.7,0.55 26.8,0.65 26.8,1.25 26.85,1.3 C70.2 28.2,1.3 28.25,1.25 28.25,0.65 28.35,0.55 31.35,0.55 32.9,2.1
  Top 0.2: U70.P$6 20.95,3.35 R19.1 20.2,3.35 20.15,3.3 20.15,3.1 19.8,2.75 16.95,2.75 16.4,3.3 15.9,3.3 R18.1 16.35,3.35 v16.35,4.25 | U60.P$11 37.45,5.7 38.4,5.7 38.5,5.6 38.5,4.8 38.4,4.7 37.45,4.7 U60.P$9 37.45,4.6 37.45,3.2 37.6,3.05 37.6,1.4 37.4,1.2 | 34.15,9.55 34.35,9.75 37.45,9.75 37.5,9.7 38.45,9.7 C61.1 | 34.15,9.55 32.9,8.3 C63.2 32.9,7.75 32.9,7.1 32.85,7.05 32.4,7.05 31.25,5.9 31.25,4.7 | 31.25,4.7 32.1,3.85 32.6,3.85 32.9,3.55 32.9,3.1 C62.2 32.9,3 32.9,2.1 | 37.4,1.2 36.65,0.45 34.55,0.45 32.9,2.1 | 37.4,1.2 38.15,0.45 43.2,0.45 44,1.25 C1.- | v31,4.65 31.2,4.65 31.25,4.7 | v34.2,9.5 34.15,9.55 | v10.4,16.35 10.4,17.9 | C27.1 54.15,6.7 54.3,6.55 54.3,5.95 | 54.3,4.05 54.3,5.95 | 54.3,4.05 54.25,4 Q3.2 | Q4.2 58.5,3.9 58.4,4 57.05,4 56.95,3.9 54.45,3.9 54.3,4.05 | v54.55,6.1 54.4,5.95 54.3,5.95 | I2C4.5 55.95,11.35 55.95,16.55 I2C3.5 55.95,16.65 55.95,22 I2C2.5 55.95,22.1 55.95,27.55 I2C1.5 55.9,26.9 52.35,26.9 52.3,26.95 | Q2.2 Q1.2 52.6,32.25 52.15,31.8 52.15,27.5 52.3,27.35 52.3,26.95 | U$3.P$3 50.4,12.8 50.4,15.3 U$3.P$6 50.4,15.4 50.4,17.85 U$3.P$9 50.4,17.95 50.4,20.35 U$3.P$12 50.4,20.45 50.4,22.9 U$3.P$15 50.4,23 50.4,25.45 U$3.P$18 50.4,25.55 50.4,26.55 | 50.4,26.55 50.4,28 U$3.P$21 50.4,28.1 50.4,30.5 U$3.P$24 50.4,30.6 50.4,32.2 50.15,32.45 50.15,33.65 48.9,34.9 U$12.P$2 48.8,34.95 48.6,34.95 47.6,35.95 46.9,35.95 45.9,34.95 44.05,34.95 U$11.P$2 44,34.85 43,33.85 43,25.35 v42.65,25 42.65,24.85 42.6,24.8 C28.1 41.1,24.8 41.05,24.75 41.05,23.75 40.7,23.35 40.1,23.35 39.9,23.2 C25.1 | 52.3,26.95 51.9,26.55 50.4,26.55 | v17,34.1 17,34.15 16.45,34.7 16,34.7 R13.1
  Top 0.2: U$1.P$10 25.7,33.7 25.7,32.7 v25.55,32.55 26.6,31.5 26.6,31.35 | v25.35,29.4 26.65,29.4 27.15,28.9 27.5,28.9 | 27.5,28.9 27.55,28.9 27.95,29.3 27.95,29.7 26.6,31.05 26.6,31.35 | 26.6,31.35 v26.4,31.35 | v30.7,26.4 29.1,26.4 28.45,25.75 27.9,25.75 26.95,26.7 26.95,28.3 27.5,28.85 27.5,28.9 | v1.55,26.15 v2.3,25.4 | U4.2 17.45,16 18.55,16 19.05,15.5 19.05,14.4 19.55,13.9 19.55,13.85 19.9,13.5
  Bottom 0.2: C19.1 20.25,25.75 20.7,25.75 20.75,25.7 20.75,24.6 20.7,24.55 20.25,24.55 C20.1 20.15,24.55 v19.2,24.55 | U90.CD2 15.05,21.45 15.05,21.3 v12.35,21.3 12.3,21.25 12.3,20.8 v11,19.5 | C90.1 7.8,28.7 v8.5,28 | U90.6 4.55,17.15 4,17.15 2.9,16.05 2.9,14.2 2.85,14.15 1.95,14.15 U90.GND3 | v6.15,16.85 5.85,17.15 4.65,17.15 U90.6 | v4.85,27.15 4.85,26.85 2.85,24.85 | 2.85,24.85 1.85,23.85 1.85,21.85 1.35,21.35 1.35,19.6 3.6,17.35 3.6,17.2 3.65,17.15 3.9,17.15 U90.6 | C7.1 7.15,7.2 7.15,5.65 8.3,4.5 8.3,3.7 8.35,3.65 8.65,3.65 U2.2 8.75,3.65 9.15,3.65 10.1,4.6 10.1,6.3 v10.15,6.35 11,6.35 11.05,6.3 C9.1 13.2,6.3 13.7,5.8 U3.2 15.6,5.8 15.65,5.75 | 15.65,5.75 15.65,4.95 v16.35,4.25 17.5,3.1 R15.1 | U10.6 23.7,16.75 23,16.75 20.75,14.5 20.75,13.95 v20.7,13.95 20.15,13.35 20.15,10 19.55,9.4 U$10.10 19.45,9.3 19.45,6.8 C21.1 18.35,6.8 18.3,6.75 18.3,6.5 17.6,5.8 15.7,5.8 15.65,5.75 | C10.2 17.25,14.45 16.55,14.45 16.5,14.4 16.5,14.1 15.9,13.5 14.85,13.5 13.25,11.9 11.4,11.9 v10.75,12.05 10,12.8 10,13.9 10.4,14.3 v10.4,16.35 | 34,10.65 33.4,10.65 C12.1 | 34,10.65 34.2,10.7 U10.83 | 35.35,5.6 U50.7 | 35.35,5.6 36.35,4.6 37.85,4.6 38.3,4.15 39.05,4.15 39.1,4.2 SPI.7 | 34.23,9.53 35.7,8.05 35.7,5.95 35.35,5.6 | 34.23,9.53 34.05,9.7 34.05,10.6 34,10.65 | C51.1 30.15,1.85 30.15,2.2 30.85,2.9 30.85,4.5 | 30.85,4.5 30.5,4.85 27.2,4.85 27.15,4.9 27.15,5.4 C50.1 | v31,4.65 30.85,4.5 | v34.2,9.5 34.23,9.53 | C26.1 55.45,6.45 54.85,5.85 54.55,5.85 | 54.55,5.85 52.3,5.85 49.35,8.8 U$9.P$2 49.35,8.9 49.35,11.75 50.35,12.75 U$3.P$3 | 54.55,5.85 v54.55,6.1 | 12.75,35.45 13,34.7 R21.1 15.1,34.7 15.15,34.65 15.15,34.05 15.25,33.95 16.65,33.95 16.8,34.1 v17,34.1
  Bottom 0.2: 7.75,35.45 12.75,35.45 | 7.75,35.45 6.7,33.8 U$16.P$3 6.6,33.7 2.4,33.7 0.45,31.75 0.45,30.9 0.5,30.85 0.5,30.35 0.45,30.3 0.45,27.35 0.5,27.3 0.9,27.3 U90.GND1 1,27.3 1.8,27.3 1.85,27.25 1.85,26.45 v1.55,26.15 | 7.75,35.45 6.65,36.05 6.65,36.2 U$17.P$3 | C14.2 33.75,31.9 33.75,30.95 33.7,30.9 33.7,30.3 C15.2 33.6,30.25 33.2,30.25 33.2,28.4 33.15,28.35 U10.41 33.2,27.15 31.65,27.15 31.55,27.25 | U10.37 31.2,28.05 31.3,27.95 31.3,27.5 31.55,27.25 | C11.1 28.1,30.4 26.55,30.4 C16.1 26.45,30.4 26.1,30.4 26.1,31.05 v26.4,31.35 | C18.2 39.1,34.5 37.95,34.5 C17.2 37.95,34.4 37.95,34 37.6,33.65 36,33.65 35.95,33.7 | 35.95,33.7 30.45,33.7 29.5,32.85 25.6,32.85 v25.55,32.55 25.55,33.4 24.3,34.65 R11.1 24.3,35.7 24.3,36.6 23.35,37.55 14.05,37.55 13.55,37.05 13.55,35.65 12.75,35.45 | U10.26 25.7,29.05 v25.35,29.4 | v30.7,26.4 31.55,27.25 | C28.1 C13.1 | C28.1 41.65,24.85 40.75,24.85 40.65,24.75 39.7,24.75 U10.54 | v42.65,25 42.5,24.85 41.75,24.85 C28.1 | 35.95,33.7 35.95,35.25 37.7,37 41.7,37 43.75,34.95 44,34.95 U$11.P$2 | v2.3,25.4 2.85,24.85
  other vias: 2,36 66,36 66,2
  pour Bottom (isolate 0.305): 0.5,37.6 0.5,0.65 64.7,0.65 64.7,37.8 0.6,37.8 0.6,37.55
  pour Top (isolate 0.305): 0.35,37.45 0.4,37.45 0.4,0.5 64.95,0.5 64.95,37.55 0.75,37.55
GPS_RX  (via drill 0.3)
  Top 0.15: v33.2,15.85 32.9,15.85 32.1,16.65 27.05,16.65 23.5,13.1 21.8,13.1 19.85,11.15 15.8,11.15 14.5,9.85 14.5,8.65 13.35,7.5 12.05,7.5 10.45,5.9 GPS.4
  Bottom 0.15: U10.88 31.7,13.55 32.4,14.25 33.1,14.25 36.25,17.4 36.25,22 35.7,22.55 35.3,22.55 32.9,20.2 32.9,16.15 v33.2,15.85
GPS_TX  (via drill 0.3)
  Top 0.15: GPS.3 9.45,3.75 10.75,2.45 11.6,2.45 13.85,4.75 13.85,6.1 15.5,7.75 20.2,7.75 27.75,15.3 31.3,15.3 31.4,15.2 31.4,14 v31.1,13.85
  Bottom 0.15: U10.89 31.2,13.8 v31.1,13.85
GYRO_DRDY  (via drill 0.3)
  Top 0.15: U70.P$17 29.5,4.35 29.65,4.5 v29.65,6.65 | v32.05,11.05 v30.55,9.55
  Bottom 0.15: v29.65,6.65 29.4,6.9 29.4,8.4 v30.55,9.55 | v32.05,11.05 32.2,11.2 U10.87
GYRO_ENABLE  (via drill 0.3)
  Top 0.15: U70.P$16 29.45,3.85 29.95,4.35 29.95,6.2 v31.1,7.35
  Bottom 0.15: v31.1,7.35 31.1,9.9 30.7,10.3 U10.90
LED1  (via drill 0.3)
  Top 0.15: v26.2,11.05 26.2,10.65 25.05,9.5 23.3,9.5 17.9,4.1 18.05,3.7 17.6,3.7 LD1.A
  Bottom 0.15: U10.99 v26.2,11.05
LED2  (via drill 0.3)
  Top 0.15: v27.05,11.05 25.2,9.2 23.45,9.2 19.95,5.7 19.95,4.05 19.65,3.75 19.2,3.75 LD2.A
  Bottom 0.15: v27.05,11.05 27.2,11.2 U10.97
N$1  (via drill 0.3)
  Top 0.15: v32.75,23.45 33.5,24.2 33.5,31 31.95,32.55 31.95,33.7 U$1.P$5 | v31.25,21.95 28.8,19.5 v28.8,19.3
  Bottom 0.15: v31.25,21.95 v32.75,23.45 | v28.8,19.3 25.25,15.75 23.7,15.75 U10.4
N$2  (via drill 0.3)
  Top 0.15: v35.5,22 35.5,30.85 33.2,33.15 33.2,33.7 U$1.P$4 | v33.45,17.15 33.1,17.25 28.95,17.25 v28.45,17.75
  Bottom 0.15: v35.5,22 35.2,22 33.45,20.25 v33.45,17.15 | v28.45,17.75 27.7,17.75 25.2,15.25 23.7,15.25 U10.3
N$3
  Bottom 0.15: C18.1 40.4,31.95 40.45,31.9 40.75,31.9 U$8.P$1 40.35,31.9 39.8,31.9 39.75,31.85 39.25,31.85 36.7,29.3 U10.48
N$4
  Bottom 0.15: C17.1 36.65,34.5 36.65,35.15 37.1,35.6 39.25,35.6 39.7,35.1 39.7,33.95 37.7,31.95 37.3,31.95 37.25,31.9 36.3,31.9 U$8.P$2 36.25,31.95 36.2,31.9 U10.47
N$5
  Top 0.15: R18.2 15.9,1.6 17.55,1.6 LD1.C
N$6
  Top 0.15: R1.1 20.1,28.6 20.1,28.15 19.65,27.7 18.15,27.7 18.1,27.65 18.1,27 U1.4
N$7
  Top 0.15: R19.2 19.2,1.65 LD2.C
N$8
  Top 0.4: 14.8,26.9 14.8,26.45 C3.1 | 14.8,26.9 14.85,26.95 16.15,26.95 U1.6 | D2.1 10.15,25.55 10.55,25.95 10.55,27.3 11.3,28.05 12.25,28.05 L1.1 12.45,28.05 13.25,28.05 14.3,27 14.65,27 14.8,26.9
N$9
  Top 0.2: 18.1,23.45 18.05,23.4 16.7,23.4 16.5,23.2 16.5,22.75 R2.2 | 18.1,23.45 18.1,24.35 U1.3 | 18.1,23.45 18.3,23.25 18.3,22.8 R3.1
N$10
  Top 0.15: D3.1 9.15,22.35 9.15,22.9 10.25,24 12,24 12.35,23.65 12.35,22.05 12.95,21.45 15.2,21.45 15.65,21.9 15.65,23.3 | 15.65,23.3 16,23.65 16.15,23.65 16.2,23.7 16.2,24.35 U1.1 | C3.2 14.8,24.7 14.8,24.1 15.6,23.3 15.65,23.3
N$12  (via drill 0.3)
  Top 0.15: v36.55,5.2 37.4,5.2 U60.P$10 | v37.3,6.9 37.3,7.6 37.5,7.8 38.45,7.8 C61.2
  Bottom 0.15: v36.55,5.2 36.55,6.15 v37.3,6.9
N$13
  Top 0.15: U60.P$8 36.65,3.95 36.65,2.25 C60.2
N$14
  Top 0.15: U60.P$12 37.45,6.2 38.4,6.2 38.85,5.75 38.85,3.5 38.55,3.2 38.55,2.25 C60.1
N$15
  Top 0.15: U70.P$15 29,3.35 29.05,3.3 C70.1
N$16
  Top 0.15: R6.1 19.45,15.7 18.75,16.4 18.45,16.4 18.4,16.45 U4.4
N$17  (via drill 0.3)
  Top 0.15: v27.9,17.2 28.15,16.95 32.85,16.95 33.75,16.05 33.75,15.75 36.8,12.65 38.45,12.65 38.8,13 38.8,13.4 37.75,14.45 37.75,18.9 36.95,19.7 36.95,23.5 35.8,24.65 35.8,31.65 34.45,33 34.45,33.7 U$1.P$3
  Bottom 0.15: v27.9,17.2 27.6,17.2 25.15,14.75 23.7,14.75 U10.2
N$18
  Top 0.4: U4.6 16.5,16.5 16.45,16.45 15.3,16.45 15.25,16.5 C8.1 15.1,16.85 13.6,16.85 13.55,16.9 12.7,16.9 L2.1 12.55,16.9 11.6,16.9 11.55,16.85 11.55,16.55 10.6,15.6 D5.1
N$19
  Bottom 0.15: U10.40 32.7,30.2 32.65,30.25 32,30.25 C15.1 31.9,30.25 31.85,30.25 31.85,31.9 C14.1
N$20
  Top 0.2: 18.45,14.7 | 18.45,14.7 U4.3
  Top 0.254: 18.25,12.95 18.45,12.95 18.45,14.7
  Top 0.406: R7.2 R8.1 18.25,12.9 18.25,12.95
N$21  (via drill 0.3)
  Top 0.15: v10.6,13 D6.1 | v14.95,14.1 15.25,14.4 C8.2 15.25,15.95 15.3,16 15.9,16 16.5,15.4 U4.1
  Bottom 0.15: v10.6,13 13.85,13 v14.95,14.1
N$22
  Top 0.15: Q1.3 55.35,33.2 55.35,35.45 55.4,35.5 55.4,36.5 U$13.-
N$23  (via drill 2)
  other vias: 2,2
N$24
  Top 0.15: Q2.3 60.7,33.2 60.7,35.4 60.65,35.45 60.65,36.45 U$15.-
N$25  (via drill 0.3)
  Top 0.15: Q3.3 56.3,4.95 v56.75,4.5 | v57,3.3 56.4,3.3 55.85,2.75 55.85,1.75 U$19.-
  Bottom 0.15: v56.75,4.5 56.75,3.55 v57,3.3
N$26
  Top 0.15: Q4.3 62,4.85 62,2.8 61.95,2.75 61.95,1.75 U$20.-
N$27  (via drill 0.5, 0.6)
  Top 0.4: U$4.P$1 59.05,8.3 v58.3,9.05 | v52.55,11.2 51.15,11.2 v50.95,11 | v52.1,7 52.1,5 52.3,4.8 52.3,3.65 | 52.3,3.65 52.3,3.35 52.9,2.75 53.3,2.75 53.35,2.7 53.35,1.75 U$19.+ | v57.2,0.75 58.9,0.75 59.45,1.05 59.45,1.75 U$20.+ | v52.05,3.65 52.3,3.65 | v59.9,34.3 59.2,35 58.6,35 58.15,35.45 58.15,36.45 U$15.+
  Top 0.406: U$13.+ 51.75,36.5 v51.4,36.65
  Bottom 0.4: v58.3,9.05 58.15,9.6 58.15,12.05 58.65,12.55 58.65,13.05 58.2,13.5 54.85,13.5 v52.55,11.2 | v50.95,11 51.15,10.8 51.15,9.15 52.1,8.2 v52.1,7 | v52.05,3.65 55.15,0.55 57,0.55 v57.2,0.75 57.3,0.9 57.7,1.3 57.7,3.55 57.65,3.6 57.65,6.85 60.4,9.6 60.4,19.1 62.65,21.35 62.65,24.5 59.9,27.25 v59.9,34.3
  Bottom 0.406: v51.4,36.65 57.55,36.65 v59.9,34.3
N$29  (via drill 0.3)
  Top 0.15: v37.55,24.1 37.55,25 36.35,26.2 36.35,31.75 35.7,32.4 35.7,33.7 U$1.P$2 | v37.8,20.5 37.8,20.2 38.5,19.5 42.65,19.5 43.45,18.7 43.45,18.3 39.1,13.95 39.1,12.85 38.6,12.35 36.65,12.35 33.75,15.3 33,15.3 31.95,16.35 27.2,16.35 25.35,14.5 v25.35,14.2
  Bottom 0.15: v37.55,24.1 37.3,23.85 37.3,21 v37.8,20.5 | v25.35,14.2 24.75,14.2 24.7,14.25 23.7,14.25 U10.1
N$31
  Bottom 0.15: C19.2 21.95,25.75 23.7,25.75 U10.24
N$32
  Bottom 0.15: C20.2 21.95,24.55 22.4,24.55 22.6,24.75 22.6,24.8 22.85,25.05 22.85,25.2 22.9,25.25 23.7,25.25 U10.23
PPS  (via drill 0.3)
  Top 0.15: v30.95,20 30.95,20.45 32.2,21.7 32.2,25.2 v32.95,25.95 | 7.45,5.95 GPS.1 | 7.45,5.95 4.5,8.9 4.5,9.75 4.6,9.85 v4.6,10.3 | v25,10.2 24.6,9.8 23.15,9.8 20.2,6.85 v16.2,6.85 | 7.45,5.95 7.65,6.15 8.2,6.15 9.95,7.9 12.15,7.9 12.3,8.05 v12.5,8.3
  Bottom 0.15: v30.95,20 30.95,18.25 27.7,15.05 U10.96 27.7,10.95 26.7,9.95 25.25,9.95 v25,10.2 | v32.95,25.95 34.2,27.2 U10.43 | v4.6,10.3 4.6,11.1 4.8,11.3 4.8,11.7 4,12.45 1.6,12.45 0.45,13.65 0.45,24.3 2.2,26.05 2.2,30.6 1.5,31.3 U$10.20 | v16.2,6.85 15.1,7.9 12.9,7.9 v12.5,8.3
PWM0  (via drill 0.3)
  Top 0.15: v44.2,14.45 44.2,13.85 45.25,12.8 U$3.P$1
  Bottom 0.15: v44.2,14.45 44.2,15.4 40.85,18.75 39.7,18.75 U10.66
PWM1
  Bottom 0.15: U10.65 39.7,19.25 41.35,19.25 45.25,15.35 U$3.P$4
PWM2
  Bottom 0.15: U10.64 39.7,19.75 43.4,19.75 45.25,17.9 U$3.P$7
PWM3
  Bottom 0.15: U10.63 39.7,20.25 44.7,20.25 45.25,20.35 U$3.P$10
PWM4  (via drill 0.3)
  Top 0.15: Q1.1 53.8,34.15 54.3,33.65 v54.3,33.1 | v56.6,24.9 56.3,24.6 56.3,23.75 v56.55,23.5
  Bottom 0.15: v54.3,33.1 54.3,32.2 57.15,29.35 57.15,25.45 v56.6,24.9 | v56.55,23.5 56.3,23.75 53.4,23.75 51.45,21.8 46.4,21.8 45.3,22.9 U$3.P$13 45.25,22.85 43.15,20.75 39.7,20.75 U10.62
PWM5  (via drill 0.3)
  Top 0.15: v56.4,34.15 Q2.1 | v55.05,25.1 v55.05,23.2 | v42.25,22.75 43.65,24.15 43.65,24.2 44.9,25.45 45.25,25.45 U$3.P$16
  Bottom 0.15: v56.4,34.15 56.65,33.9 56.65,30.3 57.45,29.5 57.45,27.3 61,23.75 61,23.35 60.6,22.95 55.3,22.95 v55.05,23.2 | v55.05,25.1 51,29.15 47.55,29.15 46.4,28 46.4,26.95 45.3,25.85 45.3,25.5 U$3.P$16 | v42.25,22.75 40.75,21.25 39.7,21.25 U10.61
PWM6  (via drill 0.3)
  Top 0.15: Q3.1 52.85,5.9 52.8,5.95 v52.8,8.05 | 46.7,21.8 46.7,25.75 47.4,26.45 47.4,26.8 46.2,28 U$3.P$19 | 46.7,21.8 v46.7,15.9 | v38.1,21.3 38.35,21.05 38.35,20.55 38.8,20.1 42.4,20.1 44.1,21.8 46.7,21.8
  Bottom 0.15: v52.8,8.05 52.8,8.15 51.6,9.35 51.6,12.95 50.35,14.2 47.55,14.2 46.7,15.05 v46.7,15.9 | v38.1,21.3 38.55,21.75 39.7,21.75 U10.60
PWM7  (via drill 0.3)
  Top 0.15: Q4.1 60.05,5.8 61.7,7.45 61.7,28.55 60.55,29.7 55.9,29.7 v55,28.8 | v49.4,29.8 48.95,30.25 48.95,30.85 48.15,31.65 46.35,31.65 45.3,30.6 U$3.P$22 | v37.85,23.05 36.45,24.45 v36.45,25.25
  Bottom 0.15: v55,28.8 51.8,28.8 51.15,29.45 50.05,29.45 49.7,29.8 v49.4,29.8 | v37.85,23.05 38.65,22.25 39.7,22.25 U10.59 | v36.45,25.25 41.75,30.55 45.25,30.55 U$3.P$22
RST  (via drill 0.3)
  Top 0.15: v30.15,20.1 31.9,21.85 31.9,31.5 30.7,32.7 30.7,33.7 U$1.P$6
  Bottom 0.15: v30.15,20.1 30.15,17.95 26.7,14.5 U10.98
RXD0  (via drill 0.3)
  Top 0.15: 24.25,10.55 v24.2,10.55 23.45,10.55 20.3,7.4 16,7.4 14.45,5.85 14.45,4.8 11.75,2.05 10.6,2.05 8.75,3.9 6.85,3.9 5.45,5.3 5.45,7 3.5,8.95 3.5,9.3 U$10.2
  Bottom 0.15: U10.93 29.2,11.2 27.65,9.65 24.8,9.65 24.2,10.25 v24.2,10.55
S_RXD1  (via drill 0.3)
  Top 0.15: v38.45,15.25 40,16.8 40.6,16.8 40.8,16.6 41.3,16.6 42.9,18.2 v42.9,18.5
  Bottom 0.15: U10.85 33.2,13.3 35.15,15.25 v38.45,15.25 | v42.9,18.5 43.2,18.15 44.9,16.45 55.8,16.45 61.3,21.95 61.3,23.9 57.75,27.45 57.75,29.65 56.95,30.45 56.95,34.35 56.5,34.8 51.9,34.8 49.4,37.3 48.35,37.3 47.8,36.75 47.8,35 46.25,33.45 44.05,33.45 U$11.P$1
SCL0  (via drill 0.3)
  Top 0.15: U70.P$24 26.25,7.1 26.35,7.2 30.15,7.2 31.3,8.35 v31.85,8.35 | v34.1,6.85 34.1,6.25 34.15,6.2 34.4,6.2 U60.P$1 | R4.2 41.45,21.35 41.45,22.1 41.25,22.1 41.2,22.2 C25.2 41.2,23.4 41.25,23.45 41.85,23.45 43.35,24.95 43.35,29.1 v43.6,29.35 | v31.8,10.05 32.95,11.2 32.95,14.6 v32.15,15.4 | v33.85,23.2 34.1,23.45 34.1,25 v34.95,25.85 | v39.35,26.9 v38.35,27.9
  Bottom 0.15: v34.1,6.85 34.1,6.7 33.9,6.5 31.9,6.5 31.85,6.55 U50.5 v31.85,8.35 31.8,8.4 v31.8,10.05 | 40.85,26.75 40.85,25.85 40.75,25.75 39.7,25.75 U10.52 | 40.85,26.75 43.45,29.35 v43.6,29.35 | v32.15,15.4 32.15,18 32.5,18.35 32.5,21.85 v33.85,23.2 | v34.95,25.85 36.6,25.85 38.35,27.6 v38.35,27.9 | v39.35,26.9 40.7,26.9 40.85,26.75
SCL1  (via drill 0.3)
  Top 0.15: R17.2 55.65,8.8 55.65,8.15 55.45,7.95 C27.2 55.45,6.95 55.65,6.75 60.55,6.75 60.8,7 60.8,9.25 59.7,10.35 59.7,11.3 I2C4.2 59.7,11.4 59.7,16.55 I2C3.2 59.7,16.65 59.7,22.05 I2C2.2 59.7,22.1 59.7,23.05 v59.2,23.55 59.7,24.05 59.7,27.55 I2C1.2
  Bottom 0.15: v59.2,23.55 58.7,24.05 45,24.05 44.25,23.3 41.2,23.3 40.75,23.75 39.7,23.75 U10.56
SD_DETECT  (via drill 0.3)
  Top 0.15: v22.45,18.8 v22.45,21.8
  Bottom 0.15: v22.45,21.8 22.45,23.05 22.65,23.25 23.7,23.25 U10.19 | v22.45,18.8 22.45,18.05 21.65,17.25 15.55,17.25 15.05,16.75 15.05,15.8 U90.CD1
SDA0  (via drill 0.3)
  Top 0.15: C28.2 41.2,26.1 41.05,25.95 R5.2 39.1,25.95 38.7,26.35 v38.45,26.35 | U70.P$28 24.25,7.1 24.15,7.2 23.85,7.2 v23.75,7.3 | v28,7.75 28.25,7.5 30,7.5 30.9,8.4 | 30.9,8.4 31.15,8.65 31.4,8.65 31.7,8.95 v32.35,8.95 | v34.1,7.65 34.45,7.3 35.1,7.3 35.15,7.25 35.15,7 U60.P$16 | v32.4,13.5 32.65,13.25 32.65,12.4 30,9.75 30,9.3 30.9,8.4
  Bottom 0.15: U10.51 39.7,26.25 38.55,26.25 v38.45,26.35 38.5,26.2 38.5,25.8 37,24.3 37,17.7 33.25,13.95 32.85,13.95 v32.4,13.5 | v23.75,7.3 27.55,7.3 v28,7.75 | v32.35,8.95 32.75,8.95 33.35,8.35 U50.6 33.4,7.65 v34.1,7.65
SDA1  (via drill 0.3)
  Top 0.15: I2C4.1 60.95,11.35 60.95,16.55 I2C3.1 60.95,16.65 60.95,22.05 I2C2.1 60.95,22.1 60.95,23.05 v60.45,23.55 60.95,24.05 60.95,27.55 I2C1.1 | v38.4,24 38.65,23.75 38.65,20.7 38.95,20.4 42.25,20.4 44.2,22.35 v44.2,24 | v51.9,24.6 v51.9,15.9
  Bottom 0.15: C26.2 54.15,7.95 53.95,8.15 R16.2 53.9,8.6 52.8,8.6 51.9,9.5 v51.9,15.9 | v38.4,24 38.65,24.25 39.7,24.25 U10.55 | v44.2,24 44.55,24.35 51.9,24.35 | 51.9,24.35 59.65,24.35 v60.45,23.55 | 51.9,24.35 v51.9,24.6
SERVO_VCC
  Top 0.4: D1.2 45.1,9.9 47.8,12.6 47.8,12.75 U$3.P$2 47.85,12.95 U$3.P$5 47.85,15.5 U$3.P$8 47.85,18.05 47.85,20.35 U$3.P$11 47.85,20.6 47.85,22.9 U$3.P$14 47.85,23.1 47.85,25.45 U$3.P$17 47.85,25.65 U$3.P$20 47.85,28.2 U$3.P$23
SPI0_CS0  (via drill 0.3)
  Top 0.15: v42.35,6.7 v40.65,6.7
  Bottom 0.15: U10.77 37.2,11.05 37.8,10.45 37.8,9.25 40.35,6.7 v40.65,6.7 | v42.35,6.7 42.85,6.2 SPI.4
SPI0_MISO  (via drill 0.3)
  Top 0.15: v41.4,13.1 41.4,12.65 v42.85,11.2 | v56.1,31.65 57.1,31.65 v57.55,31.2 | v49.6,4.8 49.35,4.8 v47.45,6.7
  Bottom 0.15: v41.4,13.1 40.25,14.25 39.7,14.25 U10.75 | v42.85,11.2 43.8,10.25 43.8,9.6 45.3,8.1 45.3,6.7 | 45.3,6.7 45.3,6.25 45.35,6.2 SPI.2 | v56.1,31.65 56.1,32.05 54.5,33.65 54.1,33.65 53.3,32.85 49.45,32.85 48.9,33.4 U$12.P$1 | v57.55,31.2 58,31.2 58.65,30.55 58.65,27.85 62.2,24.3 62.2,21.55 59.95,19.3 59.95,9.8 57.2,7.05 57.2,6.35 55.9,5.05 49.85,5.05 v49.6,4.8 | 45.3,6.7 v47.45,6.7
SPI0_MOSI  (via drill 0.3)
  Top 0.15: v41.4,11.9 42.65,10.65 44.75,10.65 v45,10.9
  Bottom 0.15: v41.4,11.9 41.95,12.45 41.95,13.55 40.75,14.75 39.7,14.75 U10.74 | v45,10.9 47.2,10.9 48,10.1 48,6.5 47.65,6.15 46.65,6.15 46.6,6.1 SPI.1
SPI0_SCK  (via drill 0.3)
  Top 0.15: v34.65,13.55 34.9,13.5 36.3,12.05 38.2,12.05 42.15,8.1 42.15,7.8 v43.55,6.7
  Bottom 0.15: U10.76 37.7,13.85 36.6,14.95 36,14.95 34.65,13.6 v34.65,13.55 | v43.55,6.7 44.1,6.15 SPI.3
SPI1_CS3  (via drill 0.3)
  Top 0.15: v7.4,20.05 8.9,18.5 v10.5,18.5 | v20.7,18.4 20.9,18.2 20.9,17.6 21.25,17.25 25.1,17.25 v26.85,19 | v27.5,19.95 27.75,19.95 31.4,23.6 31.4,30.65 30.15,31.9 v30.15,31.95
  Bottom 0.15: v7.4,20.05 5.9,21.55 5.2,21.55 U90.2 | v10.5,18.5 10.9,18.15 20.45,18.15 v20.7,18.4 | v26.85,19 26.85,19.3 v27.5,19.95 | v30.15,31.95 31.2,33 34.4,33 34.9,32.5 34.9,29.6 35.2,29.3 U10.45
SPI1_MISO  (via drill 0.3)
  Top 0.15: v6.75,16.1 6.75,15.45 8.35,13.85 v10.8,13.85 | v21.5,17.85 21.8,17.55 24.65,17.55 v24.95,17.85
  Bottom 0.15: v6.75,16.1 6.7,16.05 4.8,16.05 U90.7 | v10.8,13.85 14.8,17.85 v21.5,17.85 | v24.95,17.85 24.85,17.85 24.75,17.75 23.7,17.75 U10.8
SPI1_MOSI  (via drill 0.3, 0.3 pad 0.6)
  Top 0.15: v10.6,10.7 9.15,10.7 v7.2,12.65 | v7.35,15.6 v7.35,17.3
  Bottom 0.15: U10.7 23.02,17.27 20.6,14.9 19.45,13.55 18.7,12.7 15.15,12.7 12.85,10.4 10.9,10.4 v10.6,10.7 | v7.2,12.65 6.9,12.95 6.9,15.15 v7.35,15.6 | v7.35,17.3 7.35,18.35 5.25,20.45 4.8,20.45 U90.3
SPI1_SCK  (via drill 0.3)
  Top 0.15: v8.7,12.1 9.35,11.45 v10.25,11.45 | v19.7,14.7 22.95,14.7 v24.95,16.7
  Bottom 0.15: v8.7,12.1 9.05,12.45 9.05,14.7 5.5,18.25 4.8,18.25 U90.5 | v10.25,11.45 13.45,11.45 15,13 17.9,13 19.6,14.7 19.75,14.75 v19.7,14.7 | v24.95,16.7 24.95,17.1 25.5,17.65 25.5,18.05 25.15,18.4 24.75,18.4 24.6,18.25 23.7,18.25 U10.9
TXD0  (via drill 0.3)
  Top 0.15: v23.85,12.3 23.1,12.3 21.35,10.55 v21.35,9.65 | v21.6,6.6 21.3,6.6 20.5,5.8 v20.5,4.3 | v14.3,3.1 13.7,2.5 13.2,2.5 11.15,0.45 10.7,0.45 8.3,2.85 6.4,2.85 4.55,4.7 4.3,4.7 3.95,5.05 v3.95,7.2
  Bottom 0.15: U10.92 29.7,11.2 27.85,9.35 24.65,9.35 23.65,10.35 23.65,11.35 23.85,11.55 v23.85,12.3 | v21.35,9.65 21.6,9.4 v21.6,6.6 | v20.5,4.3 20.5,3.35 18.25,1.1 16.75,1.1 16.65,1.2 16.65,2.6 16.15,3.1 v14.3,3.1 | v3.95,7.2 3.95,7.6 5.45,9.1 5.45,9.3 U$10.3
XBEE_CTS  (via drill 0.3)
  Top 0.15: v27.3,23.6 26.75,23.45 25.1,23.45 22.05,26.5 v22.05,27.4
  Bottom 0.15: U10.95 28.2,15 31.65,18.5 31.65,20.05 29.25,22.45 27.6,22.45 27.25,22.8 27.25,23.55 v27.3,23.6 | v22.05,27.4 22.05,27.35 21.85,27.55 21.85,28.2 20.75,29.3 17.5,29.3 17.15,29.65 17.15,31 17.45,31.3 U$10.12
XBEE_RST  (via drill 0.3)
  Top 0.15: v10.2,23.2 10.2,23.1 10.35,22.95 v10.35,21.6
  Bottom 0.15: v10.2,23.2 10.2,23.45 13.6,26.85 14.15,26.85 14.5,26.5 15.15,26.5 15.95,27.3 21.15,27.3 21.6,26.85 24.25,26.85 24.8,26.3 24.8,23.8 24.75,23.75 23.7,23.75 U10.20 | v10.35,21.6 10.35,19.55 9.55,18.75 9.55,16.05 9.35,15.85 9.35,9.45 9.45,9.35 U$10.5
XBEE_RTS  (via drill 0.3)
  Top 0.15: v27.8,23 25.95,23 25.55,23.15 24.75,23.15 21.5,26.45 21.5,32.15 18.1,35.55 13.95,35.55 12.85,34.45 12.85,33.5 11.8,32.45 10.45,32.45 9.5,31.5 9.5,31.35 U$10.16
  Bottom 0.15: U10.94 28.7,15 32.05,18.4 32.05,20.15 29.15,23 v27.8,23

## Text on the board
tPlace: RC1 | RC2 | MegaFly32 v4 | 8 | 2013 F. Schill | 7 | 6 | 5 | 4 | 3 | 2 | 1
tStop: MegaFly32 1.1 Felix Schill | 2012 EPFL